# Altium schematic sheet Sheet1.SchDoc
size A3
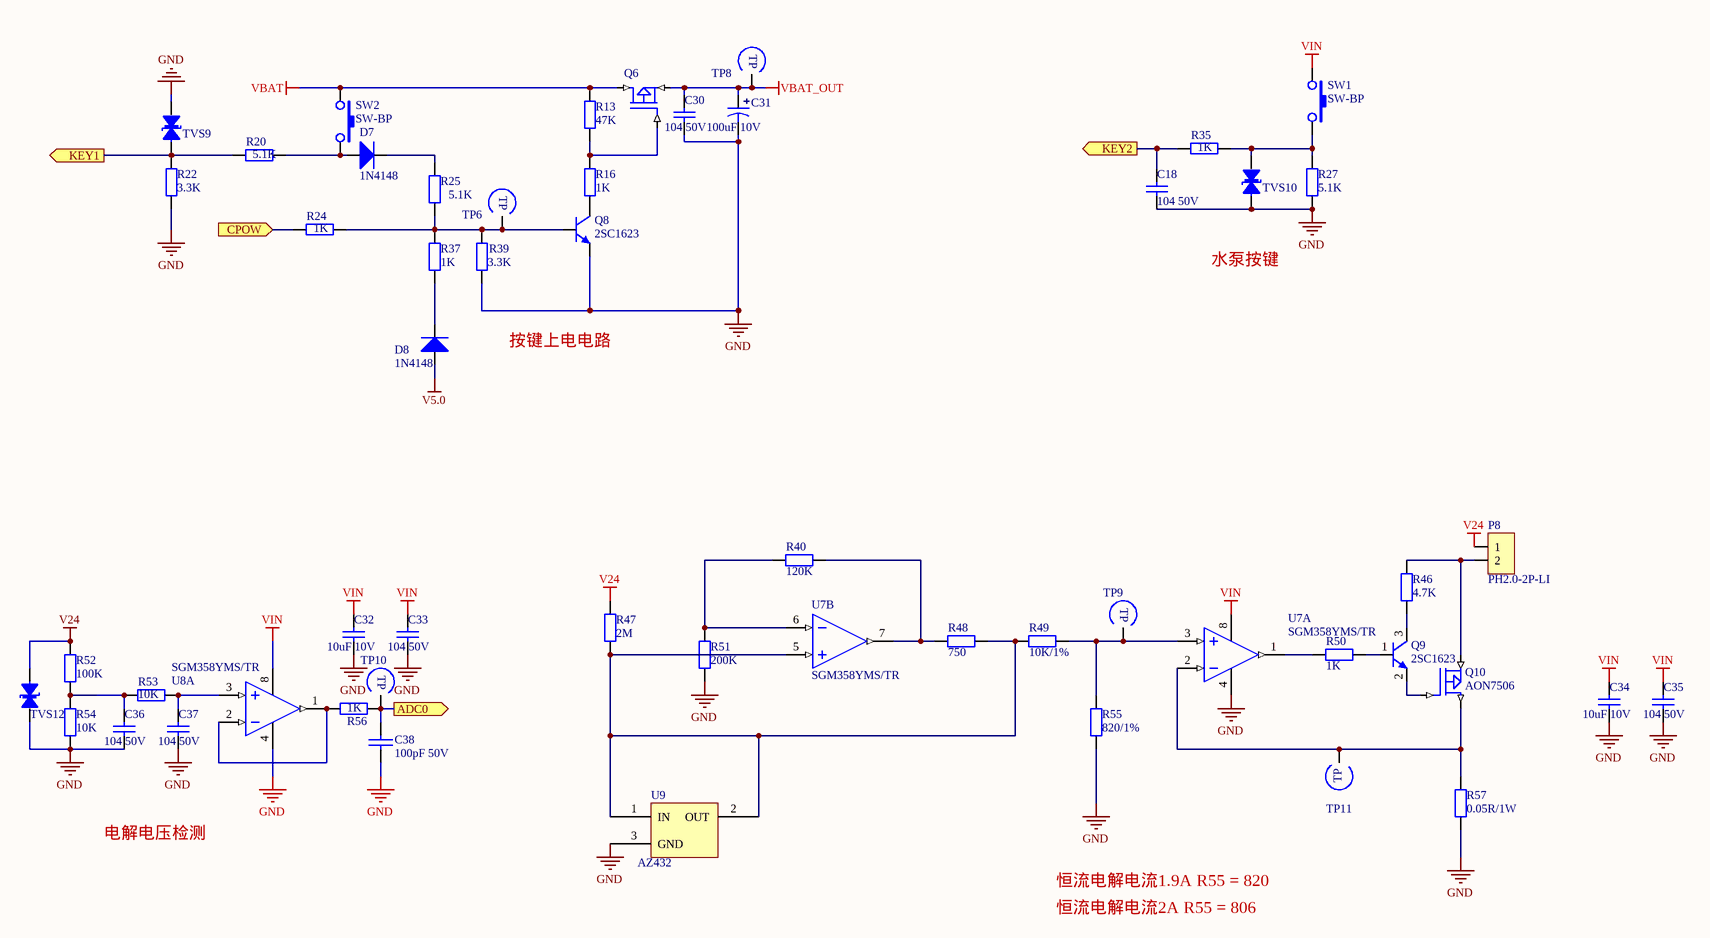
[diagram p0: Sheet1.SchDoc]

## Parts
C18  104 50V  [SMD-0603C]
C30  104 50V  [SMD-0603C]
C31  100uF 10V  [SMD-3528-B]
C32  10uF 10V  [SMD-0603C]
C33  104 50V  [SMD-0603C]
C34  10uF 10V  [SMD-0603C]
C35  104 50V  [SMD-0603C]
C36  104 50V  [SMD-0603C]
C37  104 50V  [SMD-0603C]
C38  100pF 50V  [SMD-0603C]
D7  1N4148  [SOD-523]
D8  1N4148  [SOD-523]
P8  PH2.0-2P-LI  [PH2.0-2P-LI]
Q6  AO3401  [SOT-23]  (value not drawn)
Q8  2SC1623  [SOT-23]
Q9  2SC1623  [SOT-23]
Q10  AON7506  [DFN3*3-8]
R13  47K  [SMD-0603]
R16  1K  [SMD-0603]
R20  5.1K  [SMD-0603]
R22  3.3K  [SMD-0603]
R24  1K  [SMD-0603]
R25  5.1K  [SMD-0603]
R27  5.1K  [SMD-0603]
R35  1K  [SMD-0603]
R37  1K  [SMD-0603]
R39  3.3K  [SMD-0603]
R40  120K  [SMD-0603]
R46  4.7K  [SMD-0603]
R47  2M  [SMD-0603]
R48  750  [SMD-0603]
R49  10K/1%  [SMD-0603]
R50  1K  [SMD-0603]
R51  200K  [SMD-0603]
R52  100K  [SMD-0603]
R53  10K  [SMD-0603]
R54  10K  [SMD-0603]
R55  820/1%  [SMD-0603]
R56  1K  [SMD-0603]
R57  0.05R/1W  [SMD-1206]
SW1  SW-BP  [PB-3*6*3.5侧]
SW2  SW-BP  [PB-3*6*3.5侧]
TP6  testpoint  [TP]  (value not drawn)
TP8  testpoint  [TP]  (value not drawn)
TP9  testpoint  [TP]  (value not drawn)
TP10  testpoint  [TP]  (value not drawn)
TP11  testpoint  [TP]  (value not drawn)
TVS9  ESD5Z5.0T1G  [SOD-523]  (value not drawn)
TVS10  ESD5Z5.0T1G  [SOD-523]  (value not drawn)
TVS12  NC  [SOD-123]  (value not drawn)
U7  SGM358YMS/TR  [MSOP-8]  (parts A,B of 2)
U8  SGM358YMS/TR  [MSOP-8]  (part A of 2)
U9  AZ432  [SOT-23]

## Ports
ADC0 (out), CPOW (in), KEY1 (out), KEY2 (out)

## Nets
GND: C18.1 C30.1 C31.2 C32.1 C33.1 C34.1 C35.1 C36.1 C37.1 C38.2 Q8.2(E) R22.1 R27.1 R39.1 R51.2 R54.1 R55.1 R57.1 TVS9.1(A) TVS10.2(B) TVS12.1(A) U7.4(V-) U8.4(V-) U9.3(GND)
V5.0: D8.1(A)
V24: P8.1 R47.1 R52.2 TVS12.2(B)
VBAT: Q6.2(D) R13.1 SW2.1
VBAT_OUT: C30.2 C31.1 Q6.3(S) TP8.1
VIN: C32.2 C33.2 C34.2 C35.2 SW1.1 U7.8(V+) U8.8(V+)
ADC0: C38.1 R56.1 TP10.1 ; port ADC0
CPOW: R24.1 ; port CPOW
KEY1: R20.1 R22.2 TVS9.2(B) ; port KEY1
KEY2: C18.2 R35.1 ; port KEY2
NetC36_2: C36.2 R52.1 R53.2 R54.2
NetC37_2: C37.2 R53.1 U8.3(IN1+)
NetD7_1: D7.1(A) R20.2 SW2.2
NetD7_2: D7.2(K) R25.2
NetD8_2: D8.2(K) R37.1
NetP8_2: P8.2 Q10.3(S) R46.2
NetQ6_1: Q6.1(G) R13.2 R16.2
NetQ8_1: Q8.1(B) R24.2 R25.1 R37.2 R39.2 TP6.1
NetQ9_1: Q9.1(B) R50.2
NetQ9_2: Q9.2(E) Q10.1(G)
NetQ9_3: Q9.3(C) R46.1
NetQ10_2: Q10.2(D) R57.2 TP11.1 U7.2(IN1-)
NetR27_2: R27.2 R35.2 SW1.2 TVS10.1(A)
NetR40_1: R40.1 R51.1 U7.6(IN2-)
NetR40_2: R40.2 R48.1 U7.7(OUT2)
NetR47_2: R47.2 R48.2 R49.1 U7.5(IN2+) U9.1(IN) U9.2(OUT)
NetR49_2: R49.2 R55.2 TP9.1 U7.3(IN1+)
NetR50_1: R50.1 U7.1(OUT1)
NetR56_2: R56.2 U8.1(OUT1) U8.2(IN1-)

Not connected (* = marked no-connect by the designer): Q8 3(C); R16 1

## Notes on the sheet
- 水泵按键
- 按键上电电路
- 电解电压检测
- 恒流电解电流1.9A R55 = 820
- 恒流电解电流2A R55 = 806
- (in symbol TP-1) TP

## Library data of the parts
C18 C30 C32-C37 = CAP4: 贴片电容 10%
C31 = CAP2: 钽电容
C38 = C: 贴片电容 10%
D7 D8 = DIODE2: 小封装二极管
P8 = SIP-2: 间距2.0mm 立贴 2Pin
Q6 = MOSFET P
Q8 Q9 = NPN-1: NPN
Q10 = MOSFET-P-B: MOSFET-P
R13 R16 R20 R22 R24 R25 R27 R35 R37 R39 = R: 贴片电阻 5%
R40 R46-R51 R55 R56 = R: 贴片电阻 1%
R52 R54 = RES0: 贴片电阻 1%
R53 = RES0: 贴片电阻 5%
R57 = R: 贴片电阻 0.1%
SW1 SW2 = SW-BP: 3*6*3.5侧贴按键(编带)
TP6 TP8-TP11 = TP-1: 测试点
TVS9 TVS10 TVS12 = TVS-1: ESD二极管
U7 U8 = LM358: 运放
U9 = REF3012